# Altium schematic sheet STEP-Driver.SchDoc
size A3
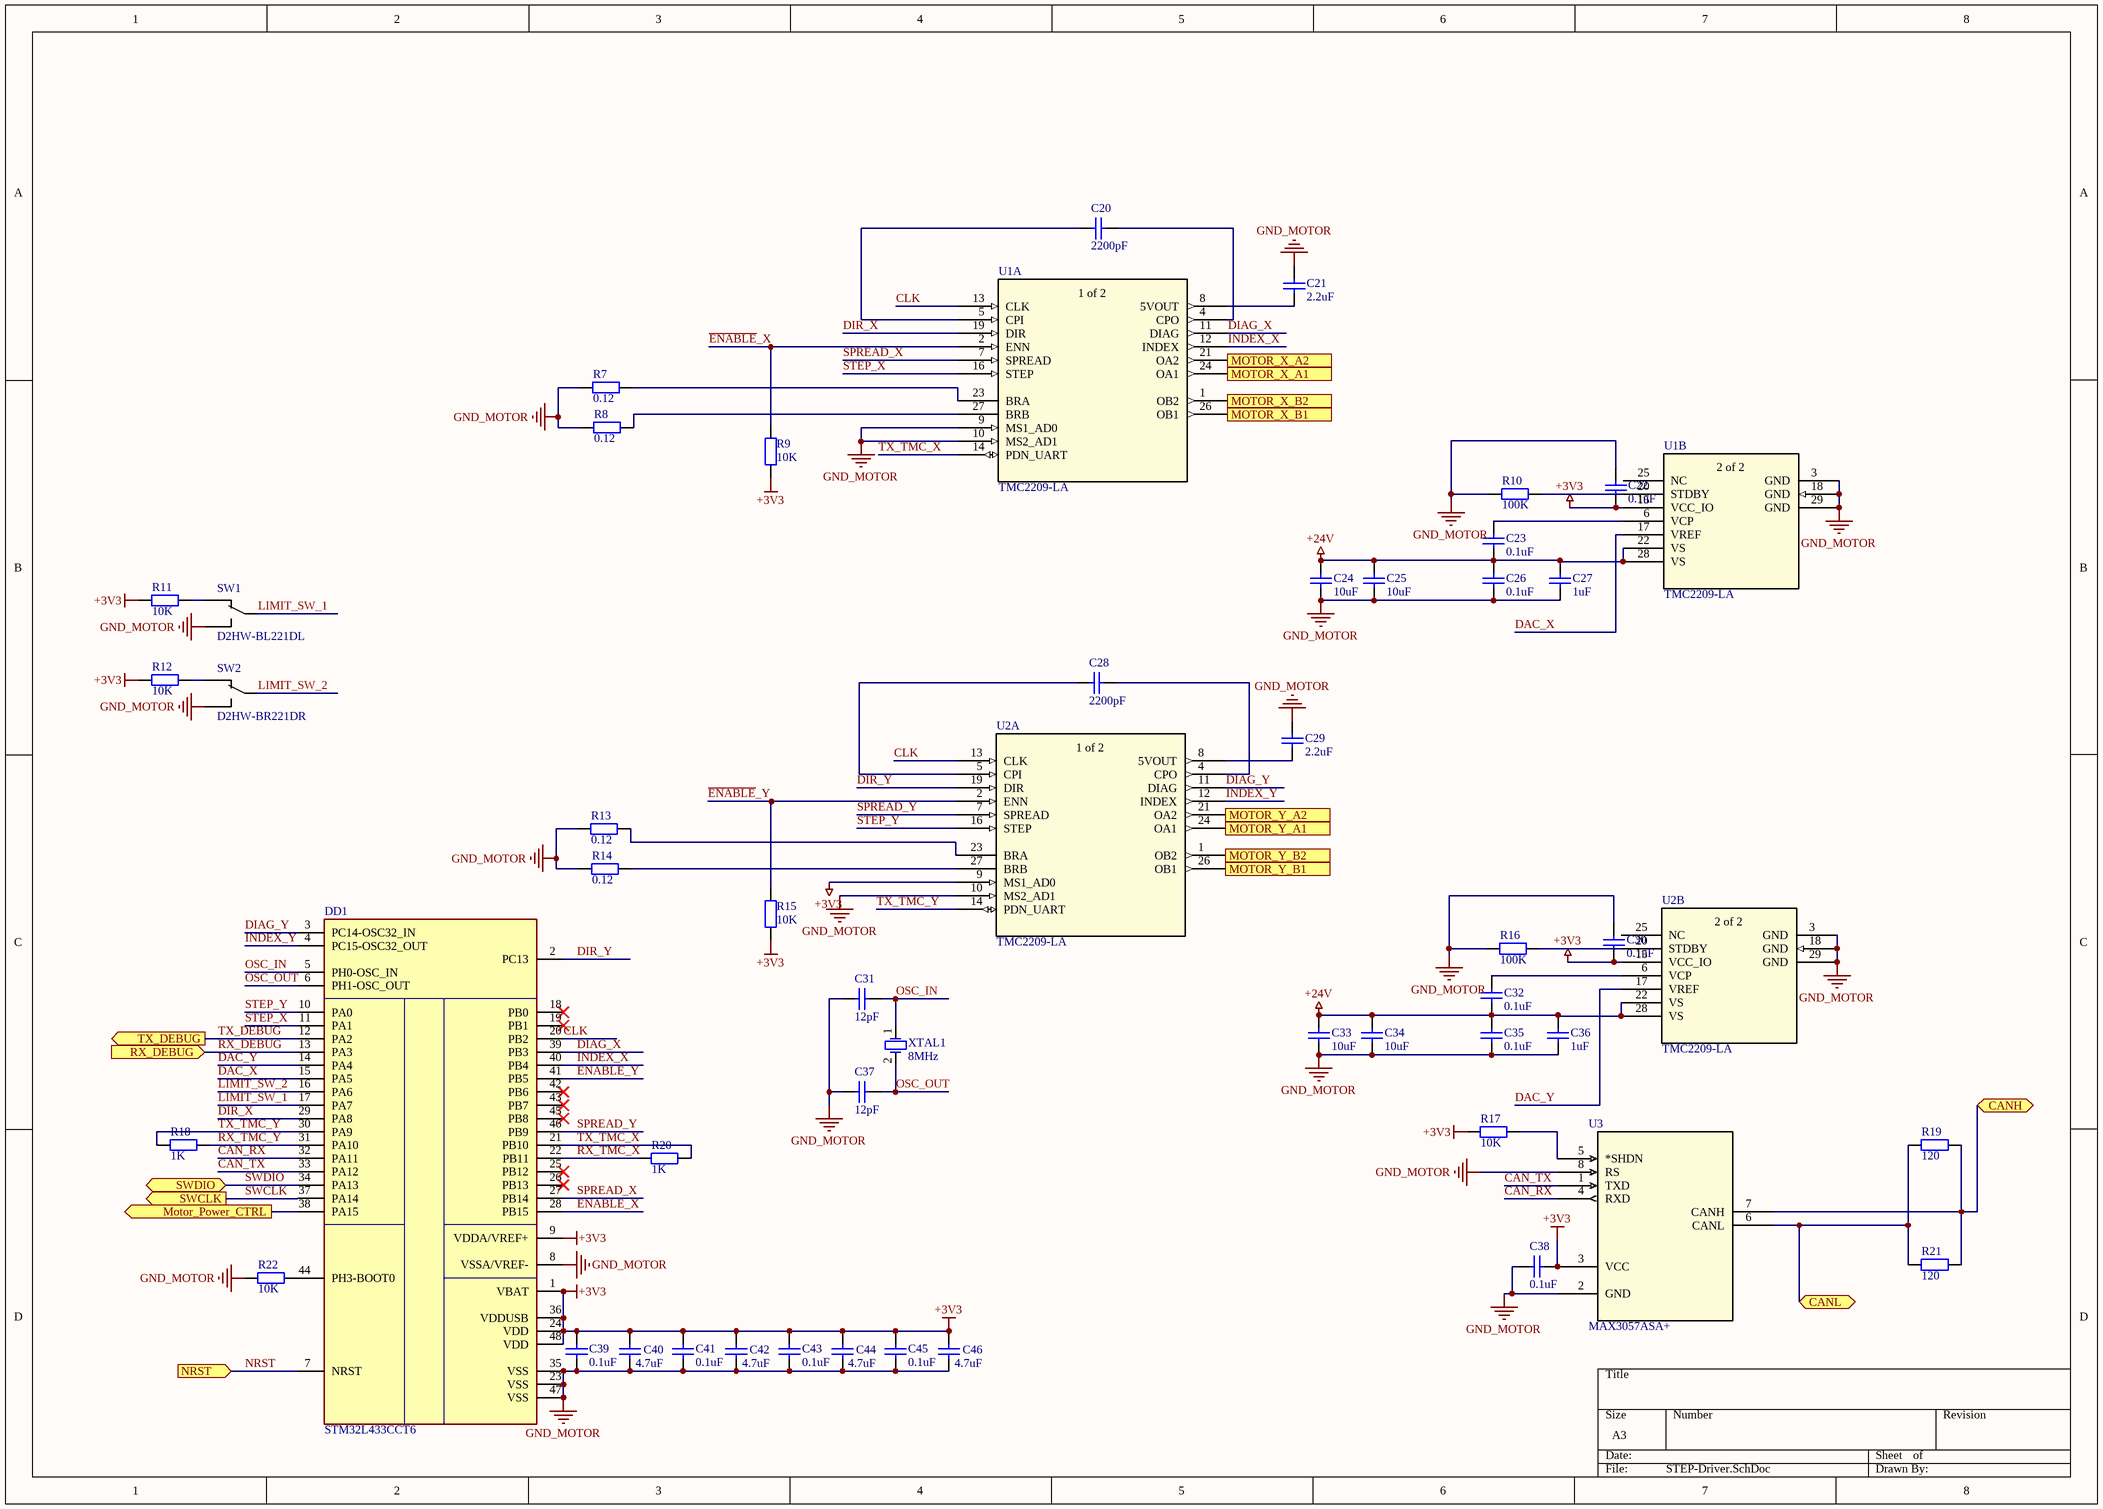
[diagram p0: STEP-Driver.SchDoc]

## Parts
C20  value 2200pF  [C0603]  (hidden comment: C0603-2200pF-50V-X7R)
C21  value 2.2uF  [C1206]  (hidden comment: C1206-2.2uF-25V-X5R)
C22  value 0.1uF  [C0603]  (hidden comment: C0603-0.1uF-50V-X7R)
C23  value 0.1uF  [C0603]  (hidden comment: C0603-0.1uF-50V-X7R)
C24  value 10uF  [C1210]  (hidden comment: C1210-10uF-50V-X7R)
C25  value 10uF  [C1210]  (hidden comment: C1210-10uF-50V-X7R)
C26  value 0.1uF  [C0603]  (hidden comment: C0603-0.1uF-50V-X7R)
C27  value 1uF  [C0603]  (hidden comment: C0603-1uF-50V-X5R)
C28  value 2200pF  [C0603]  (hidden comment: C0603-2200pF-50V-X7R)
C29  value 2.2uF  [C1206]  (hidden comment: C1206-2.2uF-25V-X5R)
C30  value 0.1uF  [C0603]  (hidden comment: C0603-0.1uF-50V-X7R)
C31  value 12pF  [C0603]  (hidden comment: C0603-12pF-50V-NP0)
C32  value 0.1uF  [C0603]  (hidden comment: C0603-0.1uF-50V-X7R)
C33  value 10uF  [C1210]  (hidden comment: C1210-10uF-50V-X7R)
C34  value 10uF  [C1210]  (hidden comment: C1210-10uF-50V-X7R)
C35  value 0.1uF  [C0603]  (hidden comment: C0603-0.1uF-50V-X7R)
C36  value 1uF  [C0603]  (hidden comment: C0603-1uF-50V-X5R)
C37  value 12pF  [C0603]  (hidden comment: C0603-12pF-50V-NP0)
C38  value 0.1uF  [C0603]  (hidden comment: C0603-0.1uF-50V-X7R)
C39  value 0.1uF  [C0603]  (hidden comment: C0603-0.1uF-50V-X7R)
C40  value 4.7uF  [C0603]  (hidden comment: C0603-4.7uF-16V-X5R)
C41  value 0.1uF  [C0603]  (hidden comment: C0603-0.1uF-50V-X7R)
C42  value 4.7uF  [C0603]  (hidden comment: C0603-4.7uF-16V-X5R)
C43  value 0.1uF  [C0603]  (hidden comment: C0603-0.1uF-50V-X7R)
C44  value 4.7uF  [C0603]  (hidden comment: C0603-4.7uF-16V-X5R)
C45  value 0.1uF  [C0603]  (hidden comment: C0603-0.1uF-50V-X7R)
C46  value 4.7uF  [C0603]  (hidden comment: C0603-4.7uF-16V-X5R)
DD1  STM32L433CCT6  [LQFP48]
R7  value 0.12  [R1210]  (hidden comment: R1210-0.12-1%)
R8  value 0.12  [R1210]  (hidden comment: R1210-0.12-1%)
R9  value 10K  [R0603]  (hidden comment: R0603-10K-1%)
R10  value 100K  [R0603]  (hidden comment: R0603-100K-1%)
R11  value 10K  [R0603]  (hidden comment: R0603-10K-1%)
R12  value 10K  [R0603]  (hidden comment: R0603-10K-1%)
R13  value 0.12  [R1210]  (hidden comment: R1210-0.12-1%)
R14  value 0.12  [R1210]  (hidden comment: R1210-0.12-1%)
R15  value 10K  [R0603]  (hidden comment: R0603-10K-1%)
R16  value 100K  [R0603]  (hidden comment: R0603-100K-1%)
R17  value 10K  [R0603]  (hidden comment: R0603-10K-1%)
R18  value 1K  [R0603]  (hidden comment: R0603-1K-1%)
R19  value 120  [R0603]  (hidden comment: R0603-120-1%)
R20  value 1K  [R0603]  (hidden comment: R0603-1K-1%)
R21  value 120  [R0603]  (hidden comment: R0603-120-1%)
R22  value 10K  [R0603]  (hidden comment: R0603-10K-1%)
SW1  D2HW-BL221DL  [D2HW-L]
SW2  D2HW-BR221DR  [D2HW-R]
U1  TMC2209-LA  [QFN28]  (parts A,B of 2)
U2  TMC2209-LA  [QFN28]  (parts A,B of 2)
U3  MAX3057ASA+  [SOIC8]
XTAL1  value 8MHz  [ABM3]  (hidden comment: ABM3-8.000MHZ-D2Y-T)

## Ports
CANH (bidir), CANL (bidir), Motor_Power_CTRL (out), MOTOR_X_A1 (out), MOTOR_X_A2 (out), MOTOR_X_B1 (out), MOTOR_X_B2 (out), MOTOR_Y_A1 (out), MOTOR_Y_A2 (out), MOTOR_Y_B1 (out), MOTOR_Y_B2 (out), NRST (in), RX_DEBUG (in), SWCLK (out), SWDIO (bidir), TX_DEBUG (out)

## Nets
+3V3: C22.1 C30.1 C38.2 C39.2 C40.2 C41.2 C42.2 C43.2 C44.2 C45.2 C46.2 DD1.1(VBAT) DD1.9(VDDA/VREF+) DD1.24(VDD) DD1.36(VDDUSB) DD1.48(VDD) R9.2 R11.1 R12.1 R15.2 R17.2 U1.15(VCC_IO) U2.9(MS1_AD0) U2.15(VCC_IO) U3.3(VCC)
+24V: C23.1 C24.2 C25.2 C26.2 C27.2 C32.1 C33.2 C34.2 C35.2 C36.2 U1.22(VS) U1.28(VS) U2.22(VS) U2.28(VS)
GND_MOTOR: C21.1 C22.2 C24.1 C25.1 C26.1 C27.1 C29.1 C30.2 C31.1 C33.1 C34.1 C35.1 C36.1 C37.1 C38.1 C39.1 C40.1 C41.1 C42.1 C43.1 C44.1 C45.1 C46.1 DD1.8(VSSA/VREF-) DD1.23(VSS) DD1.35(VSS) DD1.47(VSS) R7.1 R8.1 R10.1 R13.1 R14.1 R16.1 R22.2 SW1.3 SW2.3 U1.3(GND) U1.9(MS1_AD0) U1.10(MS2_AD1) U1.18(GND) U1.29(GND) U2.3(GND) U2.10(MS2_AD1) U2.18(GND) U2.29(GND) U3.2(GND) U3.8(RS)
CAN_RX: DD1.32(PA11) U3.4(RXD)
CAN_TX: DD1.33(PA12) U3.1(TXD)
CANH: R19.2 R21.2 U3.7(CANH) ; port CANH
CANL: R19.1 R21.1 U3.6(CANL) ; port CANL
CLK: DD1.20(PB2) U1.13(CLK) U2.13(CLK)
DAC_X: DD1.15(PA5) U1.17(VREF)
DAC_Y: DD1.14(PA4) U2.17(VREF)
DIAG_X: DD1.39(PB3) U1.11(DIAG)
DIAG_Y: DD1.3(PC14-OSC32_IN) U2.11(DIAG)
DIR_X: DD1.29(PA8) U1.19(DIR)
DIR_Y: DD1.2(PC13) U2.19(DIR)
~{ENABLE}_X: DD1.28(PB15) R9.1 U1.2(ENN)
~{ENABLE}_Y: DD1.41(PB5) R15.1 U2.2(ENN)
INDEX_X: DD1.40(PB4) U1.12(INDEX)
INDEX_Y: DD1.4(PC15-OSC32_OUT) U2.12(INDEX)
LIMIT_SW_1: DD1.17(PA7) SW1.1
LIMIT_SW_2: DD1.16(PA6) SW2.1
Motor_Power_CTRL: DD1.38(PA15) ; port Motor_Power_CTRL
MOTOR_X_A1: U1.24(OA1) ; port MOTOR_X_A1
MOTOR_X_A2: U1.21(OA2) ; port MOTOR_X_A2
MOTOR_X_B1: U1.26(OB1) ; port MOTOR_X_B1
MOTOR_X_B2: U1.1(OB2) ; port MOTOR_X_B2
MOTOR_Y_A1: U2.24(OA1) ; port MOTOR_Y_A1
MOTOR_Y_A2: U2.21(OA2) ; port MOTOR_Y_A2
MOTOR_Y_B1: U2.26(OB1) ; port MOTOR_Y_B1
MOTOR_Y_B2: U2.1(OB2) ; port MOTOR_Y_B2
NRST: DD1.7(NRST) ; port NRST
OSC_IN: C31.2 DD1.5(PH0-OSC_IN) XTAL1.1(OSC1)
OSC_OUT: C37.2 DD1.6(PH1-OSC_OUT) XTAL1.2(OSC2)
RX_DEBUG: DD1.13(PA3) ; port RX_DEBUG
RX_TMC_X: DD1.22(PB11) R20.1
RX_TMC_Y: DD1.31(PA10) R18.1
SPREAD_X: DD1.27(PB14) U1.7(SPREAD)
SPREAD_Y: DD1.46(PB9) U2.7(SPREAD)
STEP_X: DD1.11(PA1) U1.16(STEP)
STEP_Y: DD1.10(PA0) U2.16(STEP)
SWCLK: DD1.37(PA14) ; port SWCLK
SWDIO: DD1.34(PA13) ; port SWDIO
TX_DEBUG: DD1.12(PA2) ; port TX_DEBUG
TX_TMC_X: DD1.21(PB10) R20.2 U1.14(PDN_UART)
TX_TMC_Y: DD1.30(PA9) R18.2 U2.14(PDN_UART)
NetC20_1: C20.1 U1.5(CPI)
NetC20_2: C20.2 U1.4(CPO)
NetC21_2: C21.2 U1.8(5VOUT)
NetC23_2: C23.2 U1.6(VCP)
NetC28_1: C28.1 U2.5(CPI)
NetC28_2: C28.2 U2.4(CPO)
NetC29_2: C29.2 U2.8(5VOUT)
NetC32_2: C32.2 U2.6(VCP)
NetDD1_44: DD1.44(PH3-BOOT0) R22.1
NetR7_2: R7.2 U1.23(BRA)
NetR8_2: R8.2 U1.27(BRB)
NetR10_2: R10.2 U1.20(STDBY)
NetR11_2: R11.2 SW1.2
NetR12_2: R12.2 SW2.2
NetR13_2: R13.2 U2.23(BRA)
NetR14_2: R14.2 U2.27(BRB)
NetR16_2: R16.2 U2.20(STDBY)
NetR17_1: R17.1 U3.5(*SHDN)

Not connected (* = marked no-connect by the designer): DD1 18(PB0)* 19(PB1)* 25(PB12)* 26(PB13)* 42(PB6)* 43(PB7)* 45(PB8)*; U1 25(NC); U2 25(NC)

## Notes on the sheet
- (in symbol TMC2209-LA, part A) 1 of 2
- (in symbol TMC2209-LA, part B) 2 of 2

## Library data of the parts
C20 C28 = C0603-2200pF-50V-X7R: Ceramic Capacitor; Supplier 1: Digi-Key; Supplier Part Number 1: 445-1309-1-ND
C21 C29 = C1206-2.2uF-25V-X5R: Ceramic Capacitor; Supplier 1: Digi-Key; Supplier Part Number 1: 445-4045-1-ND
C22 C23 C26 C30 C32 C35 C38 C39 C41 C43 C45 = C0603-0.1uF-50V-X7R: Ceramic Capacitor; Supplier 1: Digi-Key; Supplier Part Number 1: 445-1324-1-ND
C24 C25 C33 C34 = C1210-10uF-50V-X7R: Ceramic Capacitor; Supplier 1: Digi-Key
C27 C36 = C0603-1uF-50V-X5R: Ceramic Capacitor; Supplier 1: Digi-Key; Supplier Part Number 1: PCC2174TR-ND
C31 C37 = C0603-12pF-50V-NP0: Ceramic Capacitor; Supplier 1: Digi-Key; Supplier Part Number 1: 445-1270-1-ND
C40 C42 C44 C46 = C0603-4.7uF-16V-X5R: Ceramic Capacitor; Supplier 1: Digi-Key; Supplier Part Number 1: 445-7478-1-ND
DD1 = STM32L433CCT6: Ultra-low-power Arm® Cortex®-M4 32-bit MCU+FPU, 100DMIPS,  up to 256KB Flash, 64KB SRAM; Supplier 1: Digi-Key; Supplier Part Number 1: 497-16579-ND
R7 R8 R13 R14 = R1210-0.12-1%: Chip Resistor; Supplier 1: Digi-Key; Supplier Part Number 1: 311-0.12NATR-ND
R9 R11 R12 R15 R17 R22 = R0603-10K-1%: Chip Resistor; Supplier 1: Digi-Key; Supplier Part Number 1: P10.0KHCT-ND
R10 R16 = R0603-100K-1%: Chip Resistor; Supplier 1: Digi-Key; Supplier Part Number 1: P100KHCT-ND
R18 R20 = R0603-1K-1%: Chip Resistor; Supplier 1: Digi-Key; Supplier Part Number 1: P1.00KHCT-ND
R19 R21 = R0603-120-1%: Chip Resistor; Supplier 1: Digi-Key; Supplier Part Number 1: P120HCT-ND
SW1 = D2HW-BL221DL: Limit switch; HelpUrl: https://omronfs.omron.com/en_US/ecb/products/pdf/en-d2hw.pdf; Supplier 1: Digi-Key; Supplier Part Number 1: SW718-ND
SW2 = D2HW-BR221DR: Limit switch; HelpUrl: https://omronfs.omron.com/en_US/ecb/products/pdf/en-d2hw.pdf; Supplier 1: Digi-Key; Supplier Part Number 1: D2HW-BR221DR-ND
U1 U2 = TMC2209-LA: Ultra-silent motor driver IC for two phase stepper motors.; SourceLibrary: Add_to_database_2020-10-29; Built_By: EMA_Cory; Vendor: Trinamic; Datasheet: https://www.trinamic.com/products/integrated-circuits/details/tmc2209-la/; Copyright: Copyright (C) 2018 Accelerated Designs. All rights reserved; Manufacturer_Part_Number: TMC2209-LA; RefDes: RefDes; Type: DEV
U3 = MAX3057ASA+: The MAX3050 and MAX3057 interface between the / CAN protocol controller and the physical wires of the bus / lines in a control area network (CAN). They are primarily / intended for systems requiring data rates up to 2Mbps / and feature ±80V fault protection against shorts in highvoltage power buses. They provide differential transmit / capability to the bus and differential receive capability to / the CAN controller.; SourceLibrary: Maxim_2011-10-27; Built_By: EMA_UL_Team; Vendor: Maxim Integrated Products; Revision: 3; Manufacturer_Part_Number: MAX3057ASA+; Copyright: Copyright (C) 2018 Accelerated Designs. All rights reserved; RefDes: RefDes; Type: DEV
XTAL1 = ABM3-8.000MHZ-D2Y-T: Supplier Part Number 1: 535-10630-1-ND; Supplier 1: Digi-Key; HelpUrl: https://ru.mouser.com/datasheet/2/3/abm3-47699.pdf